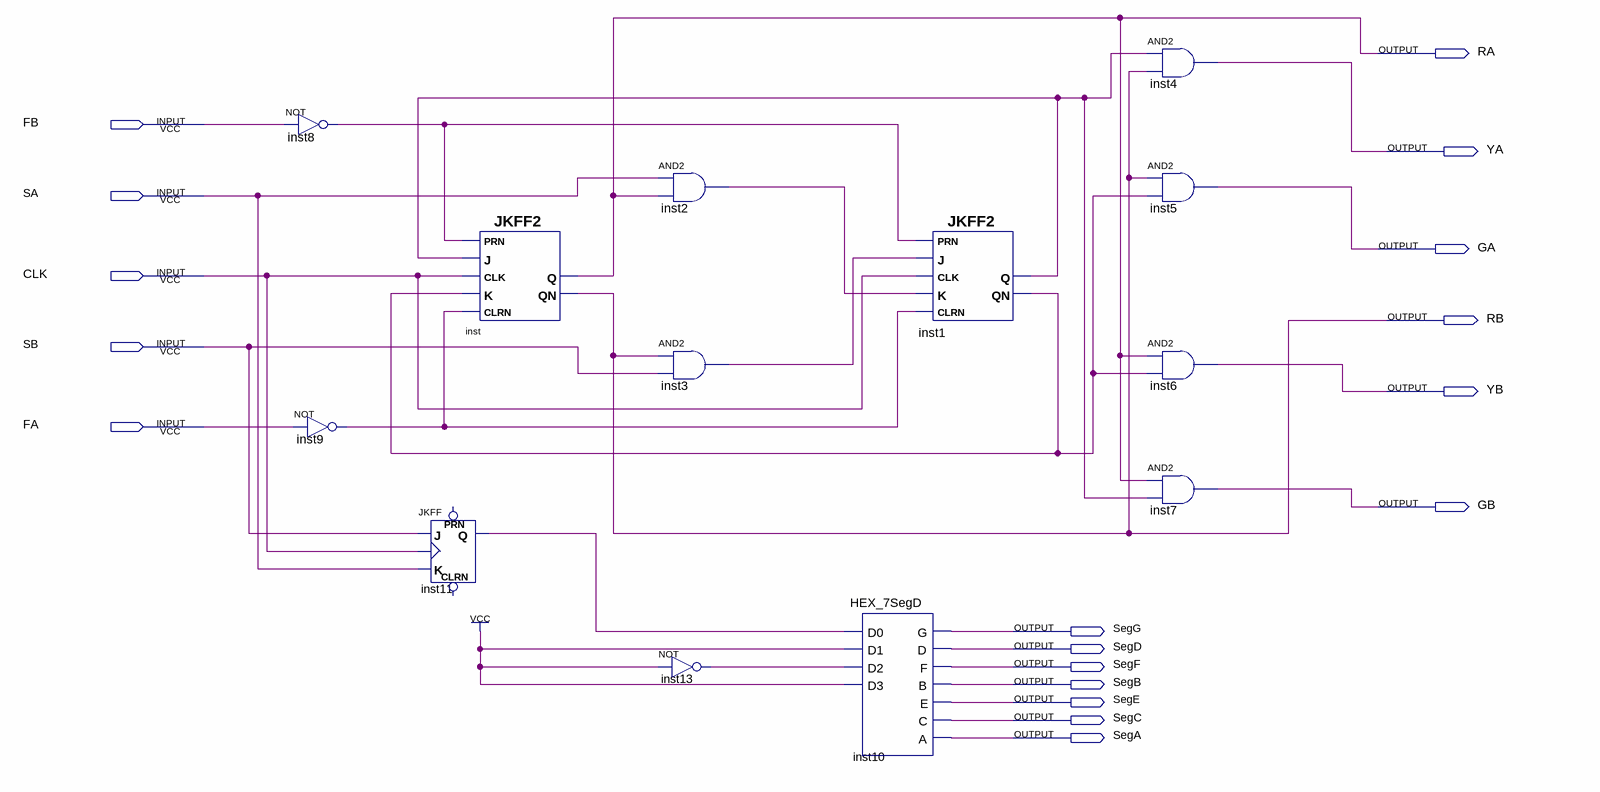
[diagram p0: schematic sheet]
// Quartus schematic TrafficLightNO.bdf as structural Verilog: 13 symbols, 18 pins
module TrafficLightNO (
  input  FB,
  input  SA,
  input  CLK,
  input  SB,
  input  FA,
  output RA,
  output YA,
  output GA,
  output RB,
  output YB,
  output GB,
  output SegG,
  output SegD,
  output SegF,
  output SegB,
  output SegE,
  output SegC,
  output SegA
);

  wire inst1_q, inst1_qn, inst2_out, inst3_out, inst8_out, inst9_out, inst11_q, inst13_out;

  not inst8 (inst8_out, FB);
  not inst9 (inst9_out, FA);
  JKFF inst11 (.K(SA), .J(SB), .CLK(CLK), .Q(inst11_q));  // open: PRN, CLRN
  JKFF2 inst (.K(inst1_qn), .CLRN(inst9_out), .CLK(CLK), .PRN(inst8_out), .J(inst1_q), .QN(RB), .Q(RA));
  and inst2 (inst2_out, SA, RA);
  and inst3 (inst3_out, RB, SB);
  not inst13 (inst13_out, 1'b1);
  HEX_7SegD inst10 (
    .D0(inst11_q), .D1(1'b1), .D2(inst13_out), .D3(1'b1), .G(SegG), .D(SegD), .F(SegF), .B(SegB), .E(SegE),
    .C(SegC), .A(SegA));
  JKFF2 inst1 (.K(inst2_out), .CLRN(inst9_out), .CLK(CLK), .PRN(inst8_out), .J(inst3_out), .QN(inst1_qn), .Q(inst1_q));
  and inst4 (YA, inst1_q, RB);
  and inst5 (GA, RB, inst1_qn);
  and inst6 (YB, RA, inst1_qn);
  and inst7 (GB, RA, inst1_q);
endmodule
